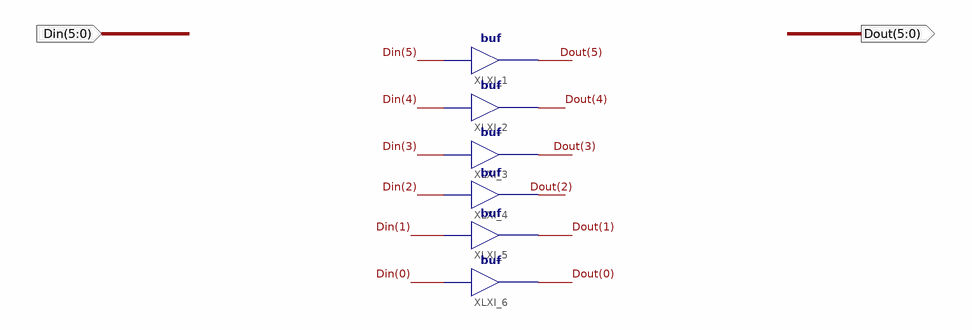
[diagram p0: schematic sheet 1]
// Xilinx ISE schematic BUF6.sch (aspartan2e) as structural Verilog: 6 symbols, 2 ports
module BUF6 (
  input  [5:0] Din,
  output [5:0] Dout
);

  buf XLXI_1 (Dout[5], Din[5]);
  buf XLXI_2 (Dout[4], Din[4]);
  buf XLXI_3 (Dout[3], Din[3]);
  buf XLXI_4 (Dout[2], Din[2]);
  buf XLXI_5 (Dout[1], Din[1]);
  buf XLXI_6 (Dout[0], Din[0]);
endmodule
